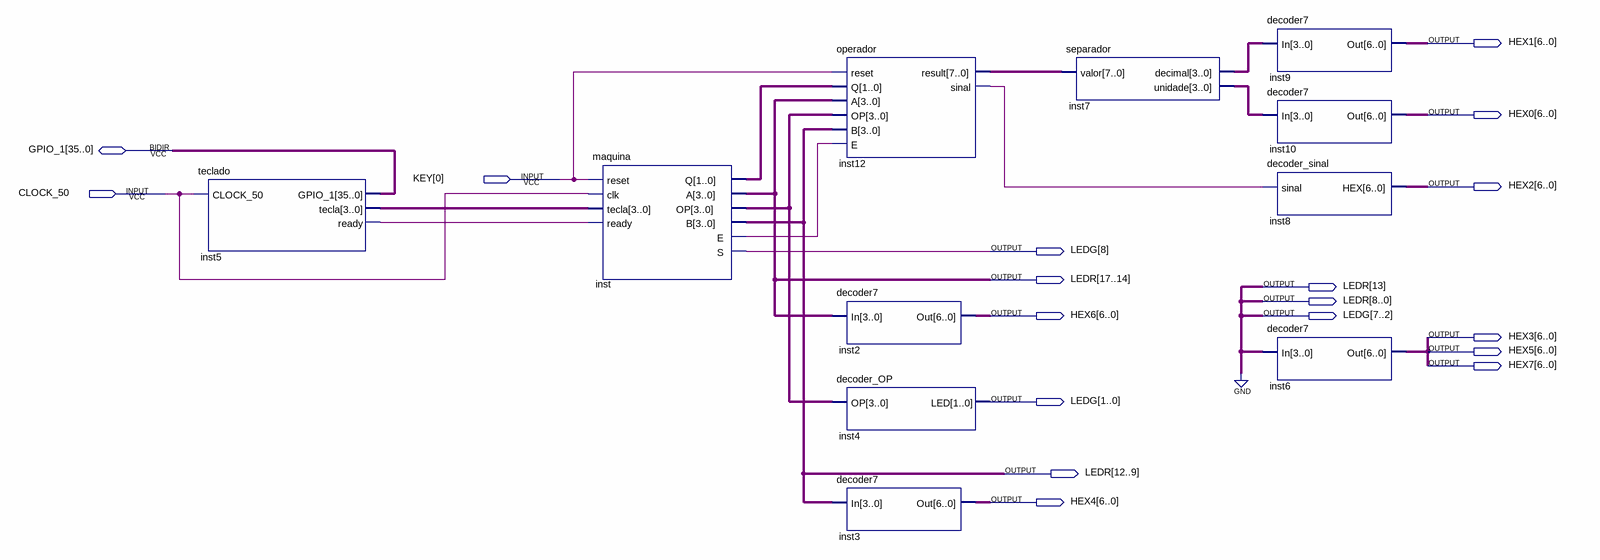
[diagram p0: schematic sheet]
// Quartus schematic calculadora.bdf as structural Verilog: 11 symbols, 18 pins
module calculadora (
  input  [0:0] KEY,
  input  CLOCK_50,
  inout  [35:0] GPIO_1,
  output [6:0] HEX1,
  output [6:0] HEX0,
  output [6:0] HEX2,
  output [8:0] LEDG,
  output [17:0] LEDR,
  output [6:0] HEX6,
  output [6:0] HEX3,
  output [6:0] HEX5,
  output [6:0] HEX7,
  output [6:0] HEX4
);

  wire inst5_ready, inst12_sinal, inst_e;
  wire [1:0] inst_q;
  wire [3:0] inst5_tecla, inst7_decimal, inst7_unidade, inst_op;
  wire [7:0] inst12_result;

  teclado inst5 (.CLOCK_50(CLOCK_50), .tecla(inst5_tecla), .ready(inst5_ready), .GPIO_1(GPIO_1));
  maquina inst (
    .reset(KEY[0]), .clk(CLOCK_50), .tecla(inst5_tecla), .ready(inst5_ready), .Q(inst_q), .A(LEDR[17:14]),
    .OP(inst_op), .B(LEDR[12:9]), .E(inst_e), .S(LEDG[8]));
  operador inst12 (
    .reset(KEY[0]), .Q(inst_q), .A(LEDR[17:14]), .OP(inst_op), .B(LEDR[12:9]), .E(inst_e),
    .result(inst12_result), .sinal(inst12_sinal));
  decoder7 inst2 (.In(LEDR[17:14]), .Out(HEX6));
  decoder_OP inst4 (.OP(inst_op), .LED(LEDG[1:0]));
  decoder7 inst3 (.In(LEDR[12:9]), .Out(HEX4));
  separador inst7 (.valor(inst12_result), .decimal(inst7_decimal), .unidade(inst7_unidade));
  decoder7 inst9 (.In(inst7_decimal), .Out(HEX1));
  decoder7 inst10 (.In(inst7_unidade), .Out(HEX0));
  decoder_sinal inst8 (.sinal(inst12_sinal), .HEX(HEX2));
  decoder7 inst6 (.In({9{1'b0}}), .Out(HEX3));

  assign HEX5 = HEX3;
  assign HEX7 = HEX3;
  assign LEDR[8:0] = {9{1'b0}};
endmodule
